# EAGLE design ESP-12F-BREAK (EAGLE 6.6.0)
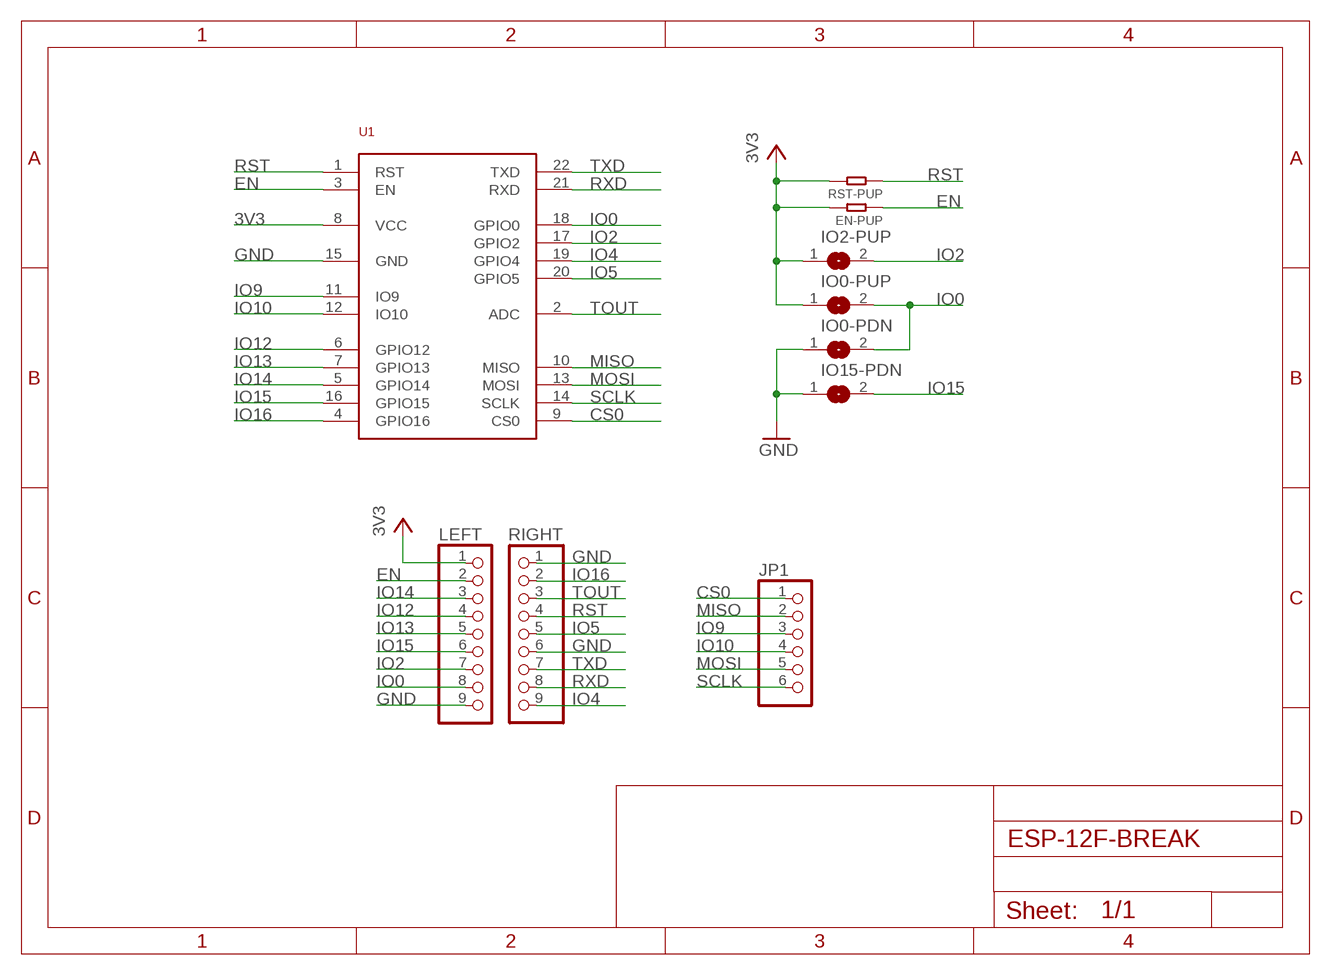
[diagram p0: schematic, sheet 1]

## Parts
EN-PUP  10K  SMD-RES-10K-1%-1/8W(0805)  [R0805]
IO0-PDN  SJ  [SJ]
IO0-PUP  SJ  [SJ]
IO2-PUP  SJ  [SJ]
IO15-PDN  SJ  [SJ]
JP1  PINHD-1X6  [1X06]
LEFT  PINHD-1X9  [1X09]
RIGHT  PINHD-1X9  [1X09]
RST-PUP  10K  SMD-RES-10K-1%-1/8W(0805)  [R0805]
U1  ESP-12F  [ESP-12F]

## Nets
3V3: EN-PUP.2 IO0-PUP.1 IO2-PUP.1 LEFT.1 RST-PUP.2 U1.8(VCC)
CS0: JP1.1 U1.9(CS0)
EN: EN-PUP.1 LEFT.2 U1.3(EN)
GND: IO0-PDN.1 IO15-PDN.1 LEFT.9 RIGHT.1 RIGHT.6 U1.15(GND)
IO0: IO0-PDN.2 IO0-PUP.2 LEFT.8 U1.18(GPIO0)
IO2: IO2-PUP.2 LEFT.7 U1.17(GPIO2)
IO4: RIGHT.9 U1.19(GPIO4)
IO5: RIGHT.5 U1.20(GPIO5)
IO9: JP1.3 U1.11(IO9)
IO10: JP1.4 U1.12(IO10)
IO12: LEFT.4 U1.6(GPIO12)
IO13: LEFT.5 U1.7(GPIO13)
IO14: LEFT.3 U1.5(GPIO14)
IO15: IO15-PDN.2 LEFT.6 U1.16(GPIO15)
IO16: RIGHT.2 U1.4(GPIO16)
MISO: JP1.2 U1.10(MISO)
MOSI: JP1.5 U1.13(MOSI)
RST: RIGHT.4 RST-PUP.1 U1.1(RST)
RXD: RIGHT.8 U1.21(RXD)
SCLK: JP1.6 U1.14(SCLK)
TOUT: RIGHT.3 U1.2(ADC)
TXD: RIGHT.7 U1.22(TXD)

## Library data of the parts
EN-PUP RST-PUP = Seeed-Resistor:SMD-RES-10K-1%-1/8W(0805): 301010361; MPN: RC0805FR-0710KL
IO0-PDN IO0-PUP IO2-PUP IO15-PDN = jumper:SJ: SMD solder JUMPER
JP1 = pinhead:PINHD-1X6: PIN HEADER
LEFT RIGHT = pinhead:PINHD-1X9: PIN HEADER
U1 = Seeed-OPL-2017-01-Sensor-camilo:ESP-12F: 317060163

## Board
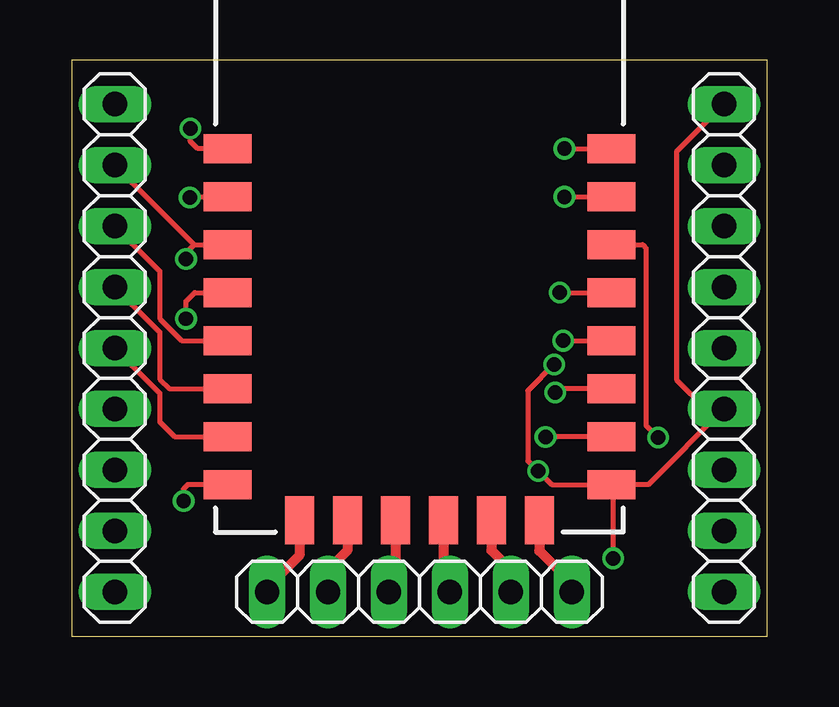
[diagram p1: board, top side]
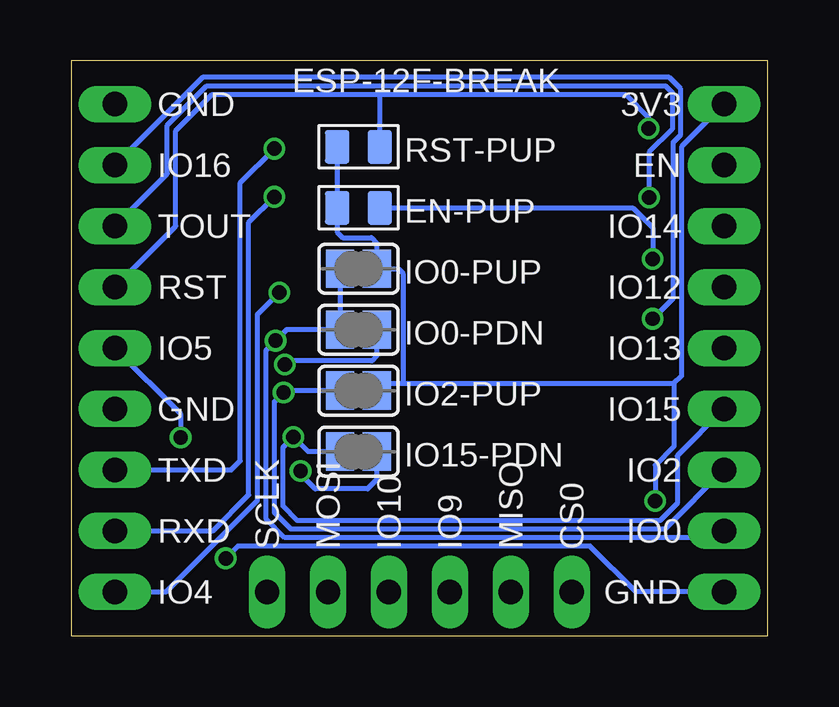
[diagram p2: board, bottom side, seen from below]

Size 29 x 24 mm. Coordinates in mm from the lower left corner, seen from the top.
Outline: 0,0 29,0 29,24 0,24 0,0
Copper layers (1*16): Top 0.035mm / dielectric 1.5mm / Bottom 0.035mm
Design rules "Fusion_eagle_rule_v1.1": minimum track width 6mil, minimum drill 12mil, track to track 6mil, track to pad 6mil, pad to pad 6mil, via to via 6mil, smd to smd 0mil, copper to edge 10mil, drill to drill 10mil, minimum pad ring 10mil, minimum via ring 6mil, stop-mask expansion 2mil, vias tented up to drill 100mil, thermal gap 10mil

### Footprints (pad centres in the part's own frame; a part is rotated, then mirrored left to right if it is on the bottom)
R0805 = smd 1.397 x 1.016: 1 0,0.889; 2 0,-0.889
SJ = smd 1.168 x 1.6: 1 -0.762,0; 2 0.762,0
1X06 = drill 1.016 long: 1 -6.35,0; 2 -3.81,0; 3 -1.27,0; 4 1.27,0; 5 3.81,0; 6 6.35,0
1X09 = drill 1.016 long: 1 -10.16,0; 2 -7.62,0; 3 -5.08,0; 4 -2.54,0; 5 0,0; 6 2.54,0; 7 5.08,0; 8 7.62,0; 9 10.16,0
ESP-12F = smd 2 x 1.2: 1 -8,3.48; 2 -8,1.48; 3 -8,-0.52; 4 -8,-2.52; 5 -8,-4.52; 6 -8,-6.52; 7 -8,-8.52; 8 -8,-10.52; 15 8,-10.52; 16 8,-8.52; 17 8,-6.52; 18 8,-4.52; 19 8,-2.52; 20 8,-0.52; 21 8,1.48; 22 8,3.48 | smd 1.2 x 2: 9 -5,-12; 10 -3,-12; 11 -1,-12; 12 1,-12; 13 3,-12; 14 5,-12

### Placement (x,y rotation side)
EN-PUP  17.04,17.84 270 bottom
IO0-PDN  17.04,12.76 180 bottom
IO0-PUP  17.04,15.3 180 bottom
IO2-PUP  17.04,10.22 180 bottom
IO15-PDN  17.04,7.68 180 bottom
JP1  14.5,1.84 0 top
LEFT  1.8,12 270 top
RIGHT  27.2,12 270 top
RST-PUP  17.04,20.38 270 bottom
U1  14.5,16.83 0 top

### Tracks (layer width: path | path; a pad name or v marks a point on that pad's centre or on a via)
3V3  (via drill 0.6)
  Top 0.203: U1.8 4.84,6.31 4.67,6.13 v4.67,5.62
  Bottom 0.203: 3.88,10.53 3.88,7.91 4.67,7.12 v4.67,5.62 | RST-PUP.2 EN-PUP.2 17.93,16.83 17.7,16.6 16.51,16.6 16.28,16.37 IO0-PUP.1 15.36,15.3 15.19,15.12 15.19,10.53 | IO2-PUP.1 16.28,10.53 15.19,10.53 | 15.19,10.53 3.88,10.53 | LEFT.1 3.58,20.38 3.58,10.83 3.88,10.53
CS0
  Top 0.406: U1.9 9.5,3.37 8.15,2.02 JP1.1
EN  (via drill 0.6)
  Top 0.203: LEFT.2 5.11,16.31 | 5.11,16.31 U1.3 | 5.11,16.31 4.77,15.96 v4.77,15.71
  Bottom 0.203: EN-PUP.1 5.61,17.84 4.77,17 v4.77,15.71
GND  (via drill 0.6)
  Top 0.203: v22.58,3.24 22.58,6.23 U1.15 | U1.15 24.05,6.31 RIGHT.6 26.44,9.46 25.22,10.68 25.22,20.18 RIGHT.1 | U1.15 20.02,6.31 v19.45,6.87 19.02,7.3 19.02,10.22 v20.11,11.31
  Bottom 0.203: LEFT.9 5.48,1.84 7.39,3.74 22.07,3.74 v22.58,3.24 | IO15-PDN.1 16.28,6.51 16.66,6.13 18.84,6.13 19.45,6.74 v19.45,6.87 | IO0-PDN.1 16.28,11.67 16.48,11.47 19.96,11.47 v20.11,11.31
IO0  (via drill 0.6)
  Top 0.203: v20.49,12.3 U1.18
  Bottom 0.203: LEFT.8 2.08,4.1 20.11,4.1 20.9,4.89 20.9,11.9 v20.49,12.3 20.04,12.76 IO0-PDN.2 IO0-PUP.2
IO2  (via drill 0.6)
  Top 0.203: U1.17 20.32,10.31 v20.16,10.15
  Bottom 0.203: LEFT.7 4.26,4.46 19.86,4.46 20.55,5.14 20.55,9.77 v20.16,10.15 20.09,10.22 IO2-PUP.2
IO4  (via drill 0.6)
  Top 0.203: v20.34,14.31 U1.19
  Bottom 0.203: RIGHT.9 25.07,1.84 21.26,5.65 21.26,13.4 v20.34,14.31
IO5  (via drill 0.6)
  Top 0.203: U1.20 23.81,16.31 23.95,16.17 23.95,8.77 v24.46,8.27
  Bottom 0.203: RIGHT.5 24.46,9.26 v24.46,8.27
IO9
  Top 0.406: U1.11 13.5,2.11 JP1.3
IO10
  Top 0.406: U1.12 15.5,2.11 JP1.4
IO12
  Top 0.203: LEFT.4 3.68,12.66 3.68,10.71 4.08,10.31 U1.6
IO13
  Top 0.203: LEFT.5 3.68,10.12 3.68,8.93 4.3,8.31 U1.7
IO14
  Top 0.203: LEFT.3 3.68,15.2 3.68,13.22 4.59,12.31 U1.5
IO15  (via drill 0.6)
  Top 0.203: 22.49,8.29 U1.16 19.77,8.31 v19.76,8.29
  Bottom 0.203: LEFT.6 3.76,7.5 3.76,5.52 4.47,4.81 19.58,4.81 20.19,5.42 20.19,7.86 v19.76,8.29 19.15,7.68 IO15-PDN.2
IO16  (via drill 0.6)
  Top 0.203: v4.77,13.22 4.77,13.96 5.13,14.31 U1.4
  Bottom 0.203: RIGHT.2 23.54,23.28 4.09,23.28 3.6,22.8 3.6,20.89 3.93,20.56 3.93,14.06 v4.77,13.22
MISO
  Top 0.406: U1.10 11.5,3.56 10.69,2.75 JP1.2
MOSI
  Top 0.406: U1.13 17.5,3.56 18.31,2.75 JP1.5
RST  (via drill 0.6)
  Top 0.203: U1.1 5.25,20.31 4.95,20.61 v4.95,21.14
  Bottom 0.203: RIGHT.4 24.66,17.08 24.66,21.04 23.14,22.57 16.15,22.57 | RST-PUP.1 16.15,22.57 | 16.15,22.57 5.91,22.57 4.95,21.6 v4.95,21.14
RXD  (via drill 0.6)
  Top 0.203: v20.55,18.3 U1.21
  Bottom 0.203: RIGHT.8 23.11,4.38 21.61,5.88 21.61,17.23 v20.55,18.3
SCLK
  Top 0.406: U1.14 19.5,3.55 20.85,2.2 JP1.6
TOUT  (via drill 0.6)
  Top 0.203: U1.2 6.47,18.27 v4.92,18.27
  Bottom 0.203: RIGHT.3 25.02,19.26 25.02,21.27 23.37,22.92 4.24,22.92 3.96,22.64 3.96,21.12 4.92,20.15 v4.92,18.27
TXD  (via drill 0.6)
  Top 0.203: v20.55,20.31 | v20.55,20.31 U1.22
  Bottom 0.203: RIGHT.7 22.35,6.92 21.97,7.3 21.97,18.88 v20.55,20.31

### Text on the board
bPlace: ESP-12F-BREAK | 3V3 | GND | EN | IO16 | IO14 | TOUT | IO12 | RST | IO13 | IO5 | IO15 | GND | IO2 | TXD | IO0 | CS0 | MISO | IO9 | IO10 | MOSI | SCLK | RXD | GND | IO4